# EAGLE design top board 3.6 (EAGLE 7.6.0)
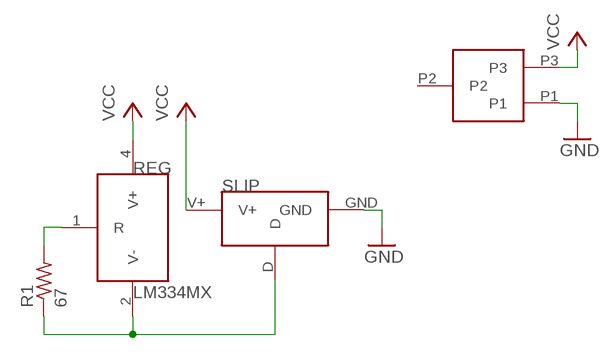
[diagram p0: schematic, sheet 1]

## Parts
R1  67  R-US_R0603  [R0603]
REG  LM334MX  [8-SOIC]
SLIP  RING2  [RING2]
U$2  AVX_CONN  [AVX_CONN]

## Nets
GND: SLIP.GND U$2.P1
N$8: R1.2 REG.1(R)
N$9: R1.1 REG.2(V-) SLIP.D
VCC: REG.4(V+) SLIP.V+ U$2.P3
Unconnected: U$2.P2

## Library data of the parts
R1 = resistor:R-US_: RESISTOR, American symbol
REG = CUSTOM:LM334MX
SLIP = CUSTOM:RING2
U$2 = CUSTOM:AVX_CONN

## Board
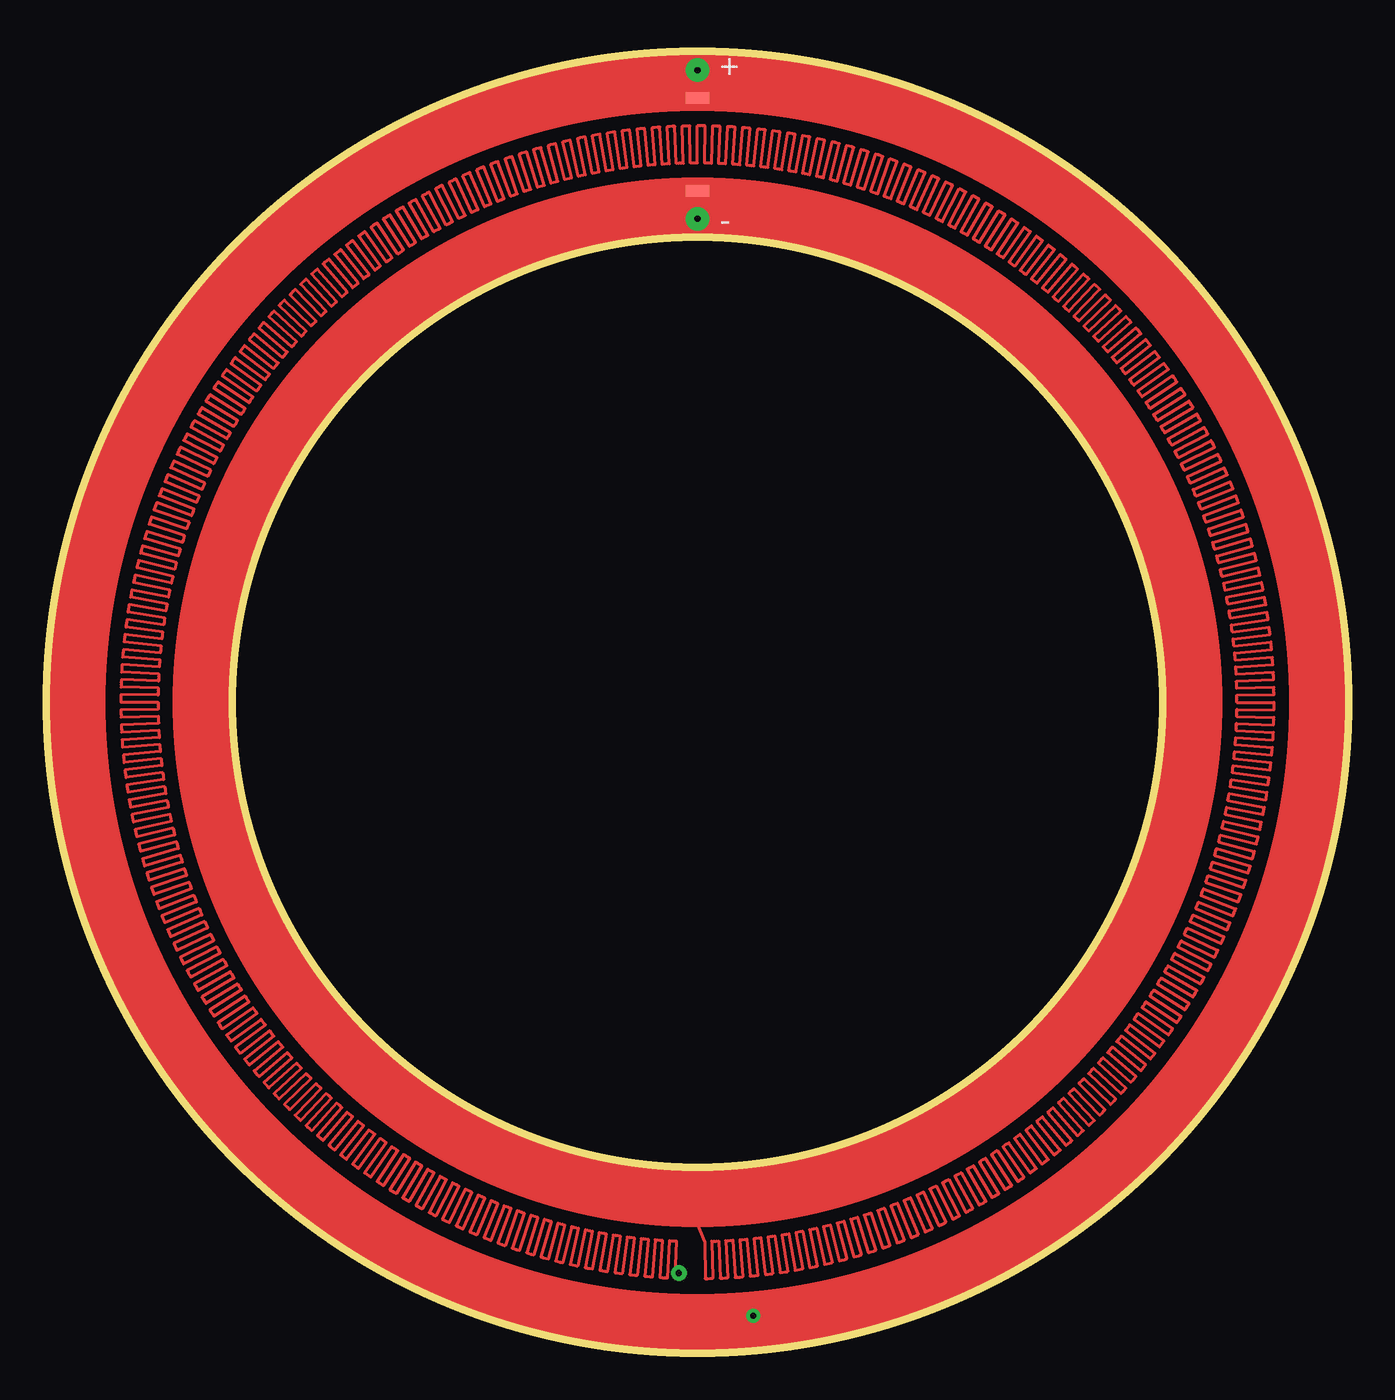
[diagram p1: board, top side]
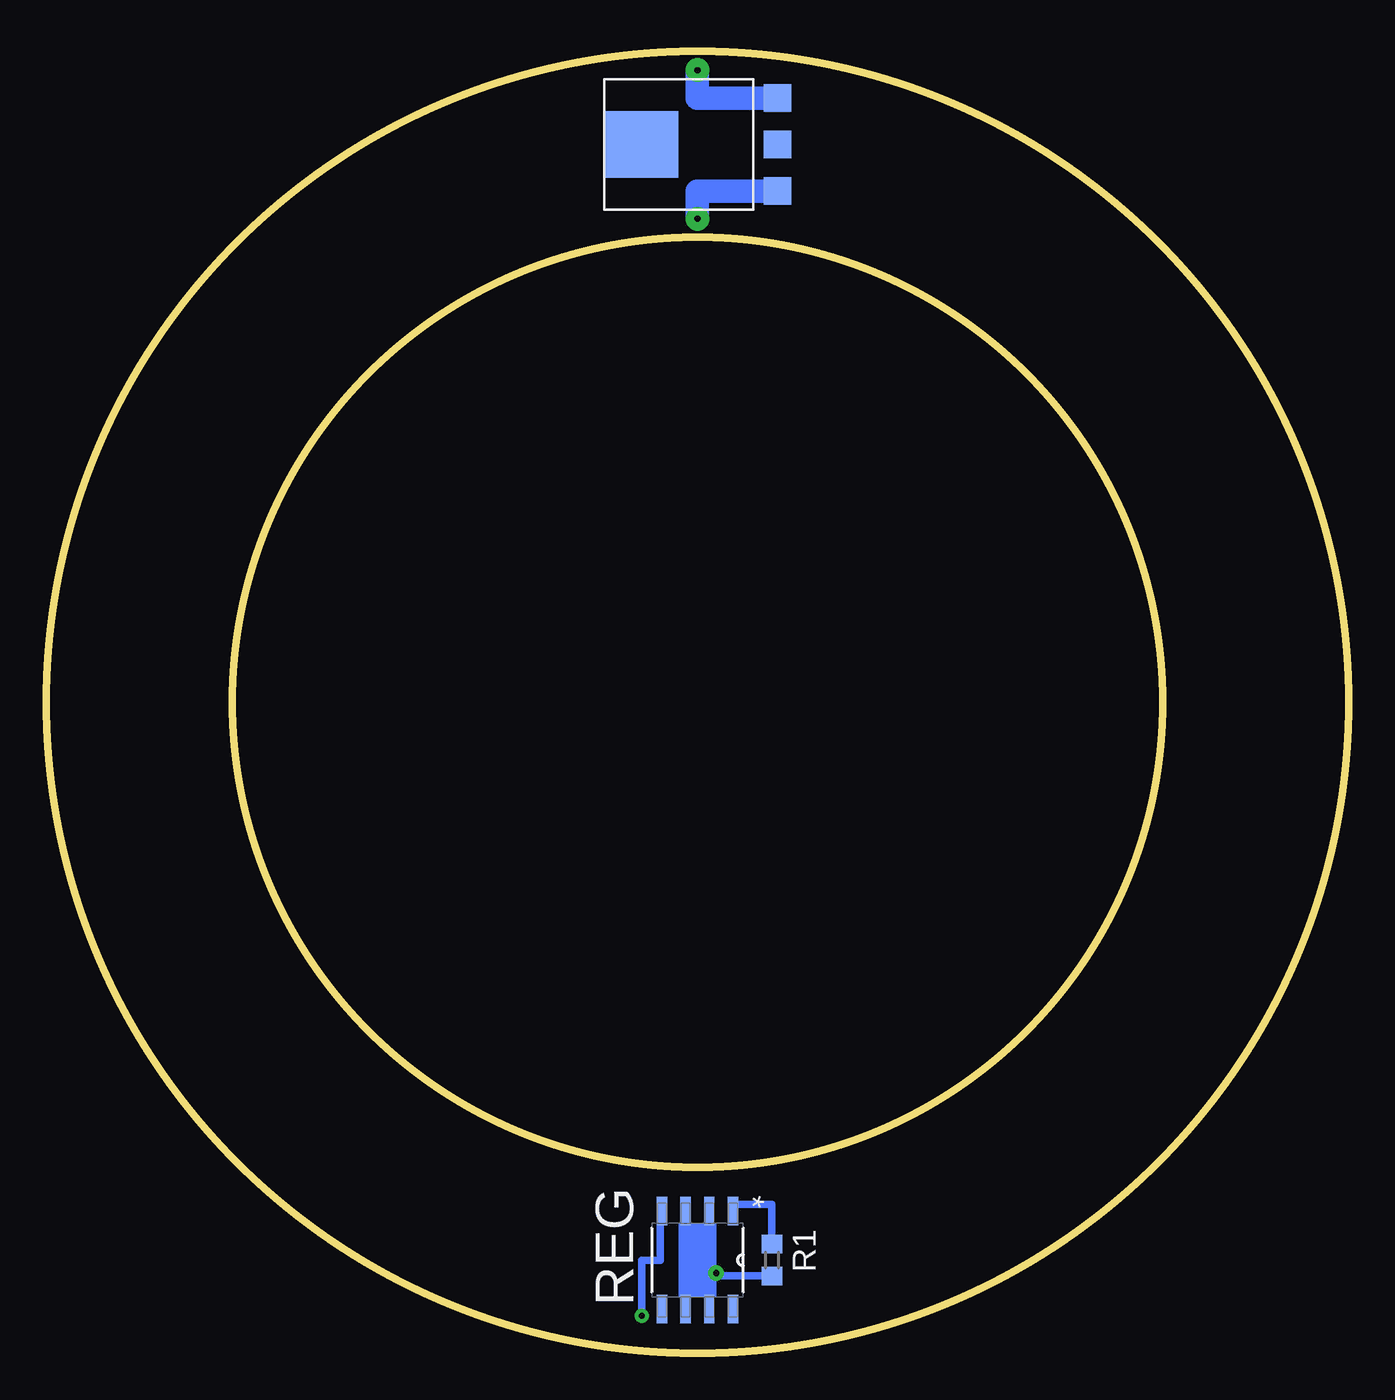
[diagram p2: board, bottom side, seen from below]

Size 70 x 70 mm. Coordinates in mm from the lower left corner, seen from the top.
Outline: circle at 35,35 radius 35
Outline: circle at 35,35 radius 25
Copper layers (1*16): Top 0.035mm / dielectric 1.5mm / Bottom 0.035mm
Design rules "default": minimum track width 10mil, minimum drill 24mil, track to track 8mil, track to pad 8mil, pad to pad 8mil, via to via 8mil, smd to smd 8mil, copper to edge 40mil, drill to drill 8mil, minimum pad ring 10mil, minimum via ring 8mil, stop-mask expansion 4mil, vias tented up to drill 0mil, thermal gap 10mil

### Footprints (pad centres in the part's own frame; a part is rotated, then mirrored left to right if it is on the bottom)
R0603 = smd 1 x 1.1: 1 -0.85,0; 2 0.85,0
8-SOIC = smd 1.524 x 0.559: 1 -2.642,1.905; 2 -2.642,0.635; 3 -2.642,-0.635; 4 -2.642,-1.905; 5 2.642,-1.905; 6 2.642,-0.635; 7 2.642,0.635; 8 2.642,1.905
RING2 = drill 0.33 pad 0.635: D -1,-30.7 | smd 1.27 x 0.635: GND 0,27.5; V+ 0,32.5
AVX_CONN = smd 1.5 x 1.5: P1 -2.5,-4.3; P2 0,-4.3; P3 2.5,-4.3 | smd 3.6 x 3.95: P$2 0,3

### Placement (x,y rotation side)
R1  31,5 90 bottom
REG  35,5 270 bottom
SLIP  35,35 0 top
U$2  35,65 90 bottom

### Tracks (layer width: path | path; a pad name or v marks a point on that pad's centre or on a via)
GND  (via drill 0.33 pad 1.27)
  Top 1.27: v35,61 SLIP.GND
  Bottom 1.27: U$2.P1 SLIP.GND v35,61
N$8
  Bottom 0.406: R1.2 31,8 33.09,8 REG.1
N$9
  Bottom 0.254: REG.2 34.29,7.64 34.29,4.45 34,4.45 SLIP.D
  Bottom 0.406: R1.1 34,4.15 SLIP.D
VCC  (via drill 0.33, 0.33 pad 1.27)
  Top 0.406: SLIP.V+ arc90 2,34.5 2,34 arc90 34,2 37,2 v38,2
  Top 1.27: v35,69 SLIP.V+
  Bottom 0.406: REG.4 arc-90 37,7.55 37,5 38,5 v38,2
  Bottom 1.27: U$2.P3 SLIP.V+ v35,69
(copper drawn outside any net)
  shapes: Bottom area x1, Top circle x2

### Text on the board
tPlace: + | -